# EasyEDA schematic test_1.json
TITLE: Sheet_1; REV: 1.0; Date: 2023-06-15; Sheet: 1/1; Company: Your Company
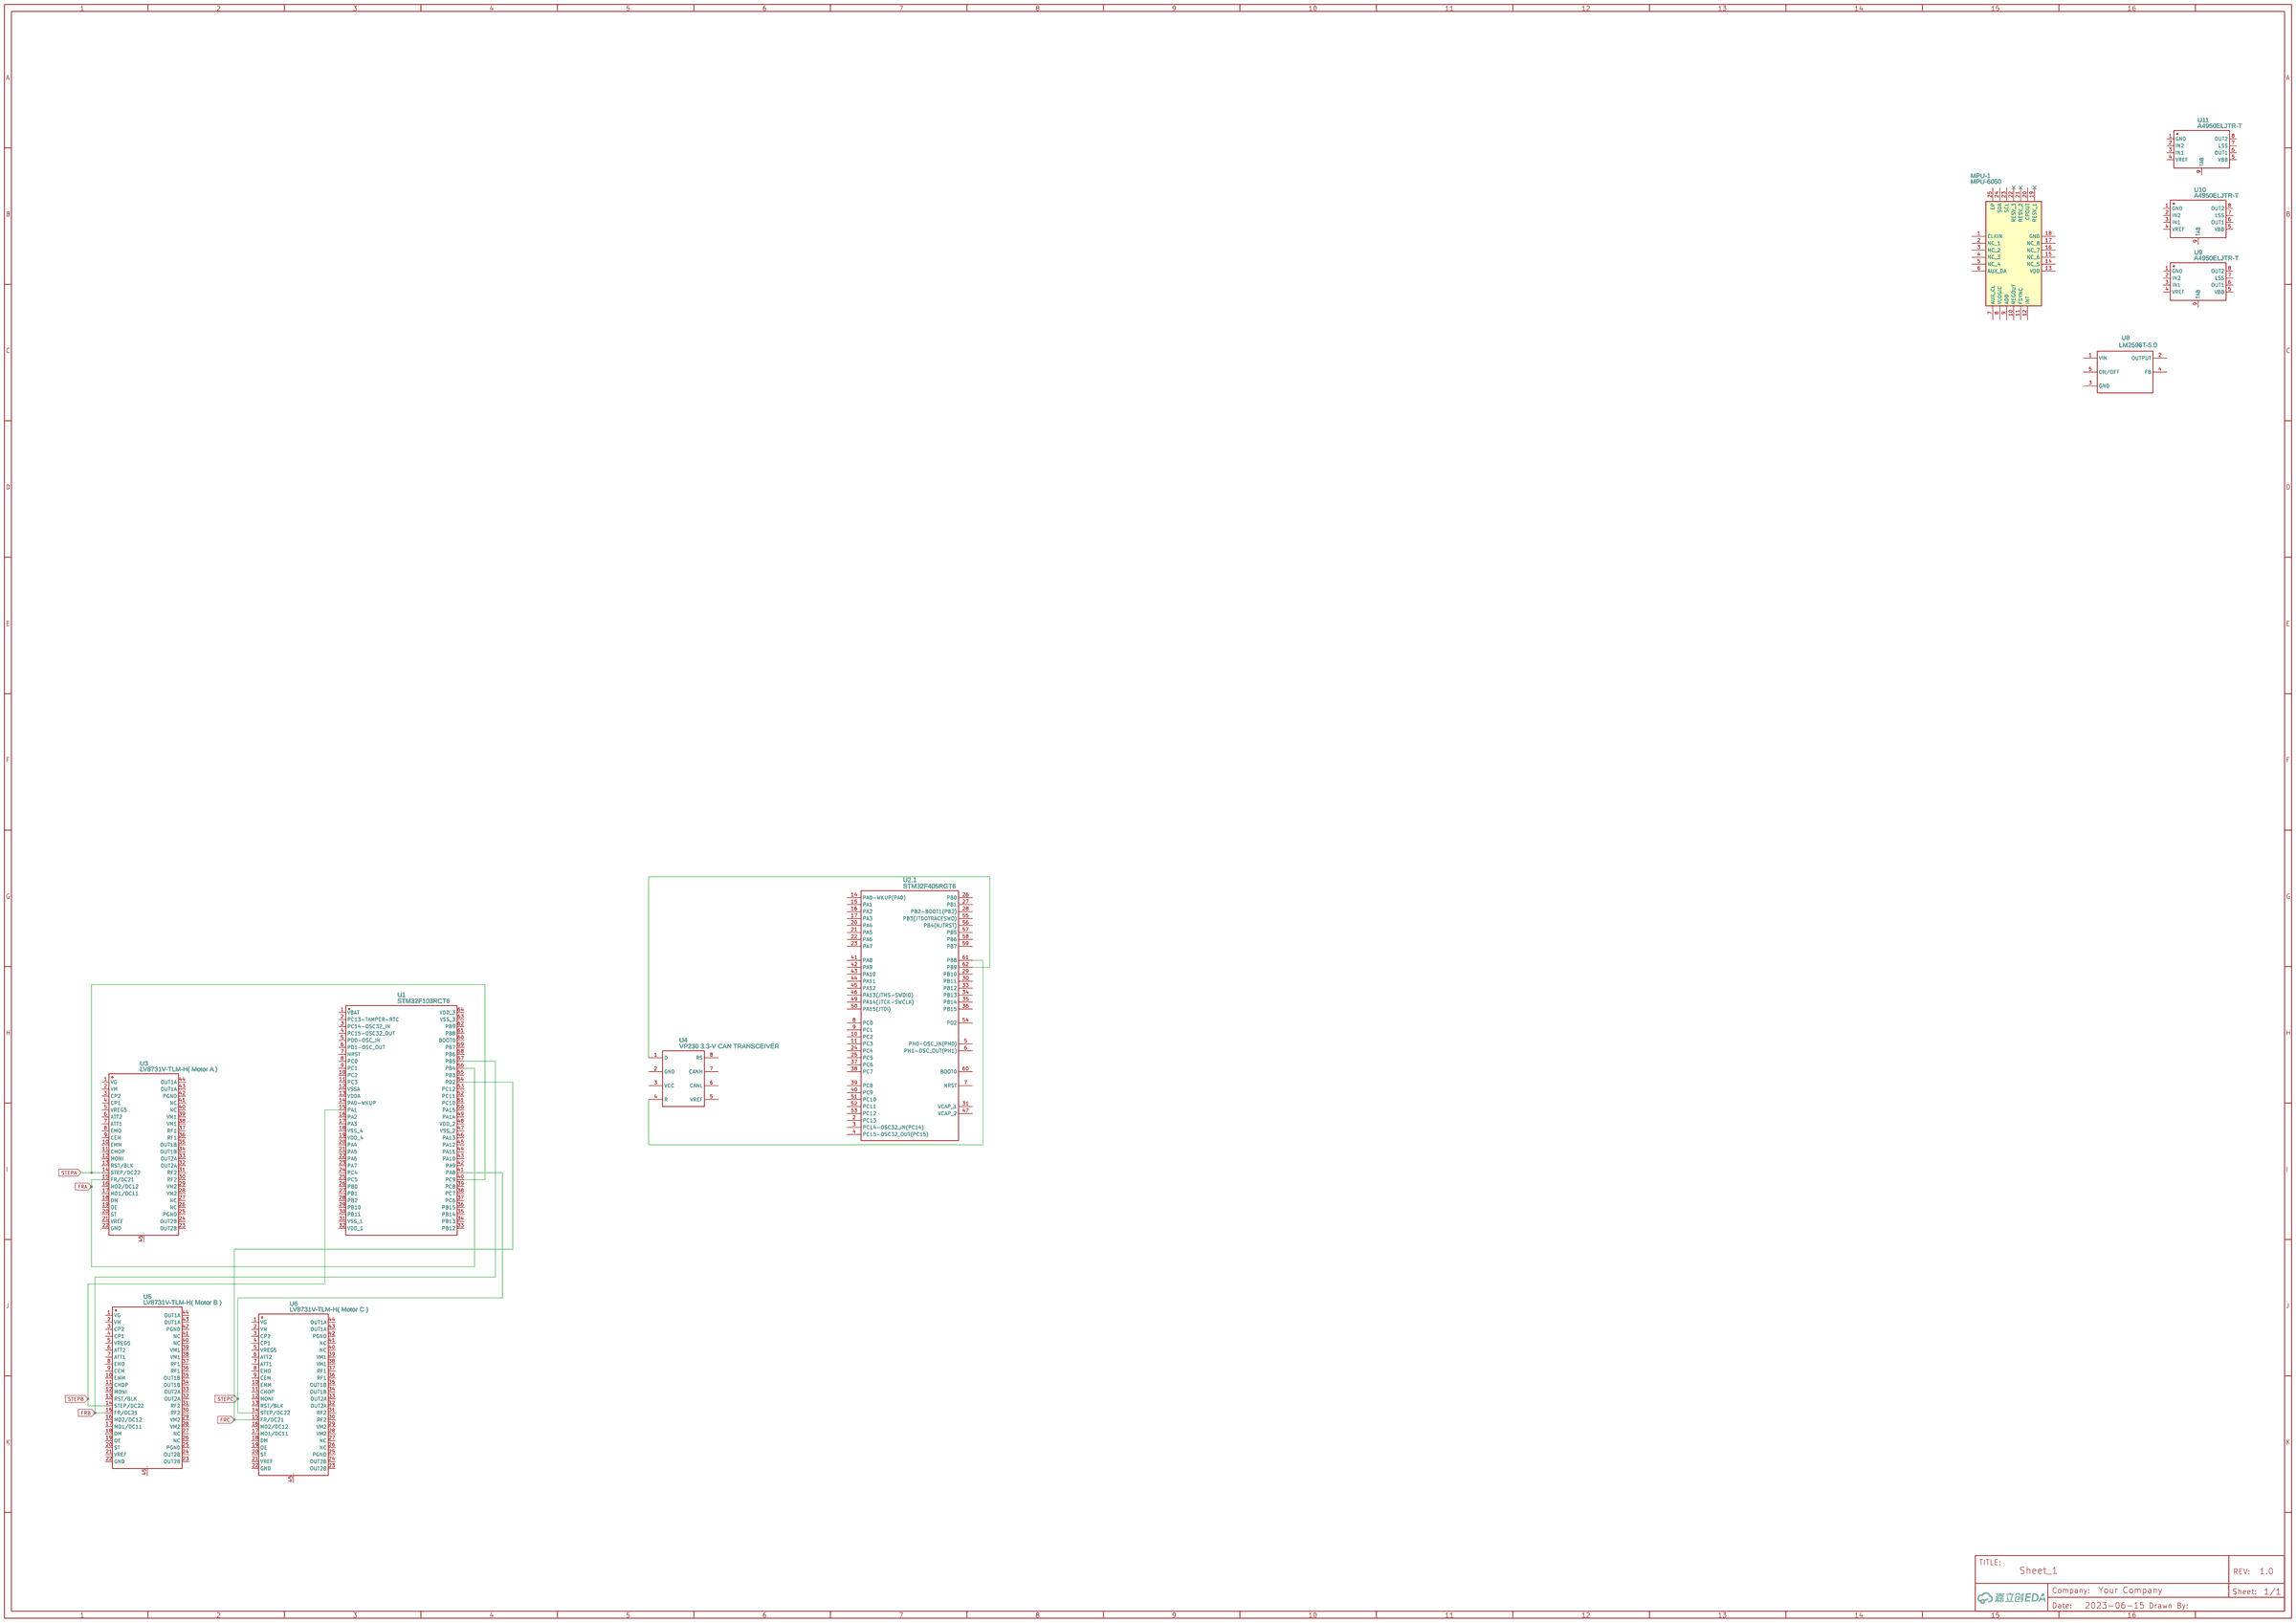
[diagram p0: schematic sheet]

## Parts
MPU-1  MPU-6050  [MPU6050]
U1  STM32F103RCT6  [LQFP-64_L10.0-W10.0-P0.50-LS12.0-BL]
U2  STM32F405RGT6  [LQFP-64_L10.0-W10.0-P0.50-LS12.0-BL]  (section 1)
U3  LV8731V-TLM-H( Motor A )  [SSOP-44_L15.5-W5.6-P0.65-LS7.6-BL-EP]
U4  VP230 3.3-V CAN TRANSCEIVER  [SOIC-8_L5.0-W4.0-P1.27-LS6.1-BL]
U5  LV8731V-TLM-H( Motor B )  [SSOP-44_L15.5-W5.6-P0.65-LS7.6-BL-EP]
U6  LV8731V-TLM-H( Motor C )  [SSOP-44_L15.5-W5.6-P0.65-LS7.6-BL-EP]
U8  LM2596T-5.0  [LM2596T]
U9  A4950ELJTR-T  [SOIC-8_EP_150MIL]
U10  A4950ELJTR-T  [SOIC-8_EP_150MIL]
U11  A4950ELJTR-T  [SOIC-8_EP_150MIL]

## Library data of the parts
MPU-1 = MPU-6050: Datasheet Link: https://product.tdk.com/system/files/dam/doc/product/sensor/mortion-inertial/imu/data_sheet/mpu-6000-datasheet1.pdf; Height: 0.95mm; Manufacturer_Name: TDK; Mouser Part Number: 410-MPU-6050; Mouser Price/Stock: https://www.mouser.co.uk/ProductDetail/TDK-InvenSense/MPU-6050?qs=u4fy%2FsgLU9O14B5JgyQFvg%3D%3D; Arrow Price/Stock: https://www.arrow.com/en/products/mpu-6050/invensense?region=nac; Contributor: quayen01
U1 = STM32F103RCT6: Supplier: LCSC; Manufacturer: ST(意法半导体); Supplier Part: C8323; JLCPCB Part Class: Extended Part
U2 = STM32F405RGT6: tags: STM32; Supplier Part: C15742; Supplier: LCSC; Manufacturer: ST(意法半导体); subpart_no: 1; image: http://image.lceda.cn/szlcsc/C15742.jpg; JLCPCB Part Class: Extended Part
U3 U5 U6 = LV8731V-TLM-H: Supplier: LCSC; Manufacturer: onsemi(安森美); Supplier Part: C40157; JLCPCB Part Class: Extended Part
U4 = VP230 3.3-V CAN TRANSCEIVER: Contributor: feroxtl
U8 = LM2596T-5.0: Supplier: LCSC; Manufacturer: HTC; Supplier Part: C126046; JLCPCB Part Class: Extended Part; Contributor: TRANTIN
U9-U11 = A4950ELJTR-T: Supplier: LCSC; Manufacturer: ALLEGRO; Supplier Part: C82404; Contributor: 沈文文

## Nets
FRA: U1.56(PB4) U3.15(FR/DC21)
FRB: U1.57(PB5) U5.15(FR/DC21)
FRC: U1.54(PD2) U6.15(FR/DC21)
STEPA: U1.40(PC9) U3.14(STEP/DC22)
STEPB: U1.15(PA1) U5.14(STEP/DC22)
STEPC: U1.41(PA8) U6.14(STEP/DC22)
Net-(U2.1-61): U2.61(PB8) U4.4(R)
Net-(U2.1-62): U2.62(PB9) U4.1(D)

Not connected (* = marked no-connect by the designer): MPU-1 1(CLKIN) 2(NC_1) 3(NC_2) 4(NC_3) 5(NC_4) 6(AUX_DA) 7(AUX_CL) 8(VLOGIC) 9(AD0) 10(REGOUT) 11(FSYNC) 12(INT) 13(VDD) 14(NC_5) 15(NC_6) 16(NC_7) 17(NC_8) 18(GND) 19(RESV_1)* 20(CPOUT) 21(RESV_2)* 22(RESV_3)* 23(SCL) 24(SDA) 25(EP); U1 1(VBAT) 2(PC13-TAMPER-RTC) 3(PC14-OSC32_IN) 4(PC15-OSC32_OUT) 5(PD0-OSC_IN) 6(PD1-OSC_OUT) 7(NRST) 8(PC0) 9(PC1) 10(PC2) 11(PC3) 12(VSSA) 13(VDDA) 14(PA0-WKUP) 16(PA2) 17(PA3) 18(VSS_4) 19(VDD_4) 20(PA4) 21(PA5) 22(PA6) 23(PA7) 24(PC4) 25(PC5) 26(PB0) 27(PB1) 28(PB2) 29(PB10) 30(PB11) 31(VSS_1) 32(VDD_1) 33(PB12) 34(PB13) 35(PB14) 36(PB15) 37(PC6) 38(PC7) 39(PC8) 42(PA9) 43(PA10) 44(PA11) 45(PA12) 46(PA13) 47(VSS_2) 48(VDD_2) 49(PA14) 50(PA15) 51(PC10) 52(PC11) 53(PC12) 55(PB3) 58(PB6) 59(PB7) 60(BOOT0) 61(PB8) 62(PB9) 63(VSS_3) 64(VDD_3); U2 2(PC13) 3(PC14-OSC32_IN(PC14)) 4(PC15-OSC32_OUT(PC15)) 5(PH0-OSC_IN(PH0)) 6(PH1-OSC_OUT(PH1)) 7(NRST) 8(PC0) 9(PC1) 10(PC2) 11(PC3) 14(PA0-WKUP(PA0)) 15(PA1) 16(PA2) 17(PA3) 20(PA4) 21(PA5) 22(PA6) 23(PA7) 24(PC4) 25(PC5) 26(PB0) 27(PB1) 28(PB2-BOOT1(PB2)) 29(PB10) 30(PB11) 31(VCAP_1) 33(PB12) 34(PB13) 35(PB14) 36(PB15) 37(PC6) 38(PC7) 39(PC8) 40(PC9) 41(PA8) 42(PA9) 43(PA10) 44(PA11) 45(PA12) 46(PA13(JTMS-SWDIO)) 47(VCAP_2) 49(PA14(JTCK-SWCLK)) 50(PA15(JTDI)) 51(PC10) 52(PC11) 53(PC12) 54(PD2) 55(PB3(JTDOTRACESWO)) 56(PB4(NJTRST)) 57(PB5) 58(PB6) 59(PB7) 60(BOOT0); U3 1(VG) 2(VM) 3(CP2) 4(CP1) 5(VREG5) 6(ATT2) 7(ATT1) 8(EMO) 9(CEM) 10(EMM) 11(CHOP) 12(MONI) 13(RST/BLK) 16(MD2/DC12) 17(MD1/DC11) 18(DM) 19(OE) 20(ST) 21(VREF) 22(GND) 23(OUT2B) 24(OUT2B) 25(PGND) 26(NC) 27(NC) 28(VM2) 29(VM2) 30(RF2) 31(RF2) 32(OUT2A) 33(OUT2A) 34(OUT1B) 35(OUT1B) 36(RF1) 37(RF1) 38(VM1) 39(VM1) 40(NC) 41(NC) 42(PGND) 43(OUT1A) 44(OUT1A) 45; U4 2(GND) 3(VCC) 5(VREF) 6(CANL) 7(CANH) 8(RS); U5 1(VG) 2(VM) 3(CP2) 4(CP1) 5(VREG5) 6(ATT2) 7(ATT1) 8(EMO) 9(CEM) 10(EMM) 11(CHOP) 12(MONI) 13(RST/BLK) 16(MD2/DC12) 17(MD1/DC11) 18(DM) 19(OE) 20(ST) 21(VREF) 22(GND) 23(OUT2B) 24(OUT2B) 25(PGND) 26(NC) 27(NC) 28(VM2) 29(VM2) 30(RF2) 31(RF2) 32(OUT2A) 33(OUT2A) 34(OUT1B) 35(OUT1B) 36(RF1) 37(RF1) 38(VM1) 39(VM1) 40(NC) 41(NC) 42(PGND) 43(OUT1A) 44(OUT1A) 45; U6 1(VG) 2(VM) 3(CP2) 4(CP1) 5(VREG5) 6(ATT2) 7(ATT1) 8(EMO) 9(CEM) 10(EMM) 11(CHOP) 12(MONI) 13(RST/BLK) 16(MD2/DC12) 17(MD1/DC11) 18(DM) 19(OE) 20(ST) 21(VREF) 22(GND) 23(OUT2B) 24(OUT2B) 25(PGND) 26(NC) 27(NC) 28(VM2) 29(VM2) 30(RF2) 31(RF2) 32(OUT2A) 33(OUT2A) 34(OUT1B) 35(OUT1B) 36(RF1) 37(RF1) 38(VM1) 39(VM1) 40(NC) 41(NC) 42(PGND) 43(OUT1A) 44(OUT1A) 45; U8 1(VIN) 2(OUTPUT) 3(GND) 4(FB) 5(ON/OFF); U9 1(GND) 2(IN2) 3(IN1) 4(VREF) 5(VBB) 6(OUT1) 7(LSS) 8(OUT2) 9(TAB); U10 1(GND) 2(IN2) 3(IN1) 4(VREF) 5(VBB) 6(OUT1) 7(LSS) 8(OUT2) 9(TAB); U11 1(GND) 2(IN2) 3(IN1) 4(VREF) 5(VBB) 6(OUT1) 7(LSS) 8(OUT2) 9(TAB)
